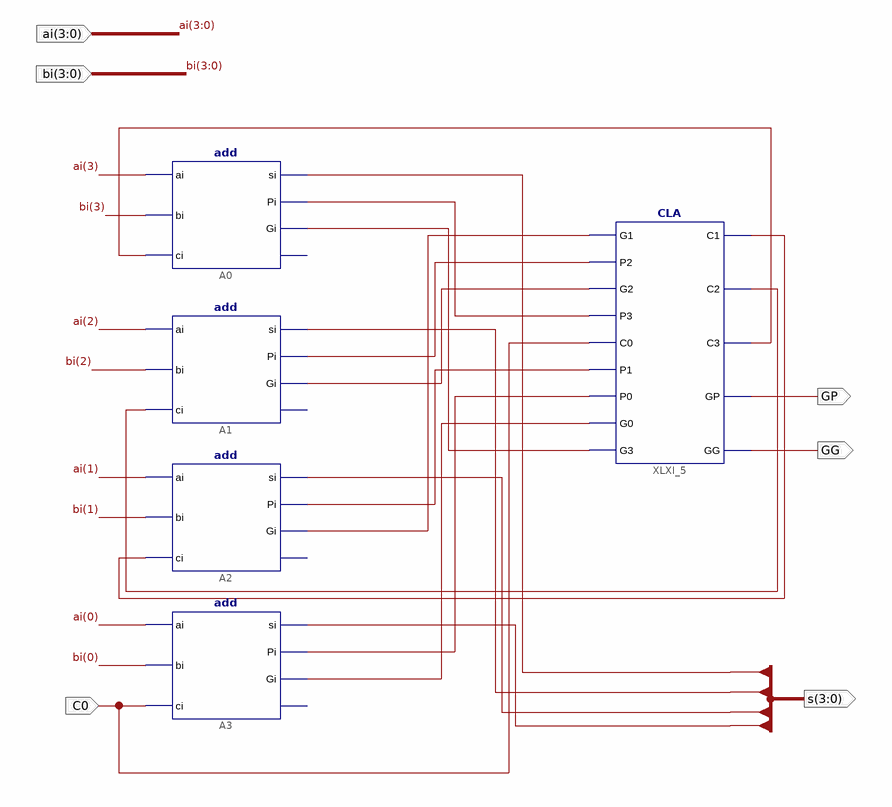
[diagram p0: schematic sheet 1]
// Xilinx ISE schematic add4b.sch (kintex7) as structural Verilog: 5 symbols, 6 ports
module add4b (
  input  [3:0] ai,
  input  [3:0] bi,
  input  C0,
  output [3:0] s,
  output GP,
  output GG
);

  wire XLXN_13, XLXN_14, XLXN_15, XLXN_16, XLXN_17, XLXN_18, XLXN_19, XLXN_20, XLXN_21, XLXN_22, XLXN_23;

  add A0 (.ai(ai[3]), .bi(bi[3]), .ci(XLXN_23), .si(s[3]), .Pi(XLXN_14), .Gi(XLXN_13));  // open: co
  add A1 (.ai(ai[2]), .bi(bi[2]), .ci(XLXN_22), .si(s[2]), .Pi(XLXN_16), .Gi(XLXN_15));  // open: co
  add A2 (.ai(ai[1]), .bi(bi[1]), .ci(XLXN_21), .si(s[1]), .Pi(XLXN_18), .Gi(XLXN_17));  // open: co
  add A3 (.ai(ai[0]), .bi(bi[0]), .ci(C0), .si(s[0]), .Pi(XLXN_20), .Gi(XLXN_19));  // open: co
  CLA XLXI_5 (
    .G1(XLXN_17), .P2(XLXN_16), .G2(XLXN_15), .P3(XLXN_14), .C0(C0), .P1(XLXN_18), .P0(XLXN_20),
    .G0(XLXN_19), .G3(XLXN_13), .C1(XLXN_21), .C2(XLXN_22), .C3(XLXN_23), .GP(GP), .GG(GG));
endmodule
